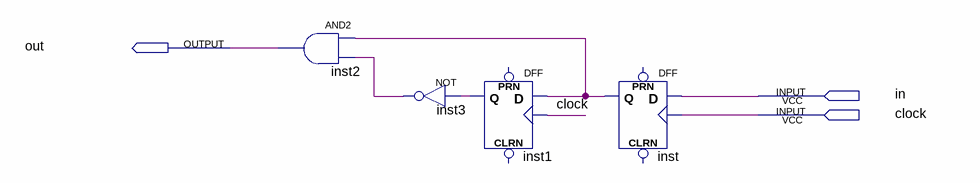
[diagram p0: schematic sheet]
// Quartus schematic single_pulse.bdf as structural Verilog: 4 symbols, 3 pins
module single_pulse (
  input  in,
  input  clock,
  output out
);

  wire inst1_q, inst3_out, inst_q;

  and inst2 (out, inst_q, inst3_out);
  not inst3 (inst3_out, inst1_q);
  DFF inst1 (.CLK(clock), .D(inst_q), .Q(inst1_q));  // open: CLRN, PRN
  DFF inst (.CLK(clock), .D(in), .Q(inst_q));  // open: CLRN, PRN
endmodule
